# Altium schematic sheet address_detector.SchDoc
size A3
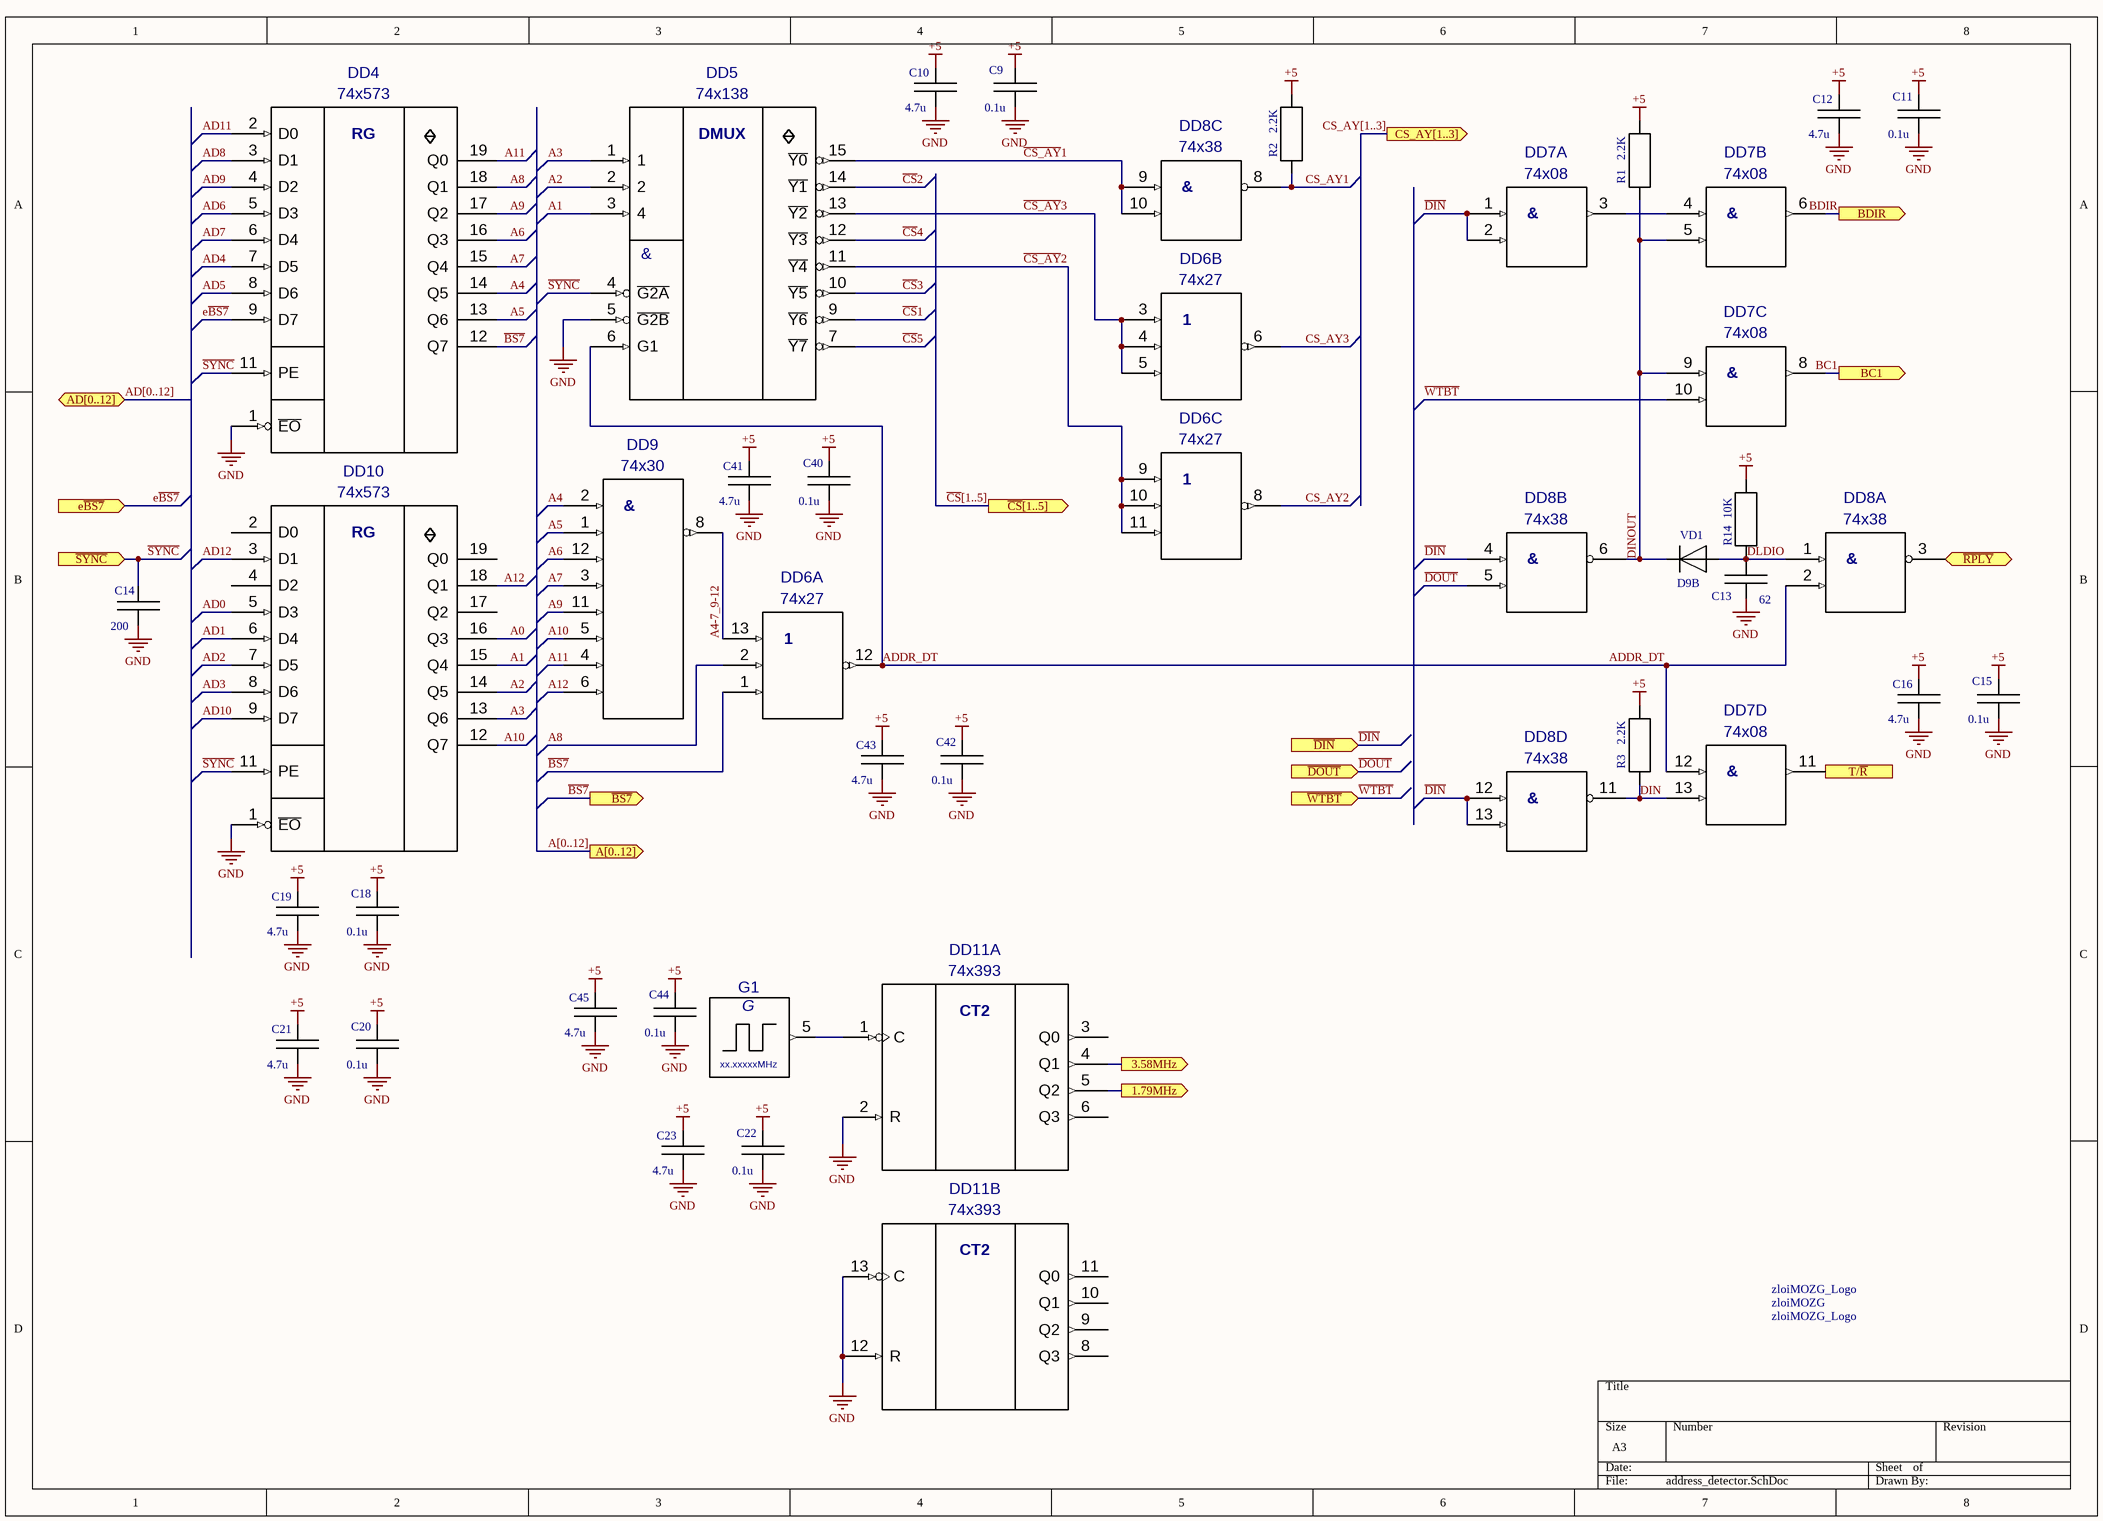
[diagram p0: address_detector.SchDoc]

## Parts
C9  0.1u  [CAP 4x2.5]
C10  4.7u  [CAP 5.5x3.15]
C11  0.1u  [CAP 4x2.5]
C12  4.7u  [CAP 5.5x3.15]
C13  62  [CAP 4x2.5]
C14  200  [CAP 4x2.5]
C15  0.1u  [CAP 4x2.5]
C16  4.7u  [CAP 5.5x3.15]
C18  0.1u  [CAP 4x2.5]
C19  4.7u  [CAP 5.5x3.15]
C20  0.1u  [CAP 4x2.5]
C21  4.7u  [CAP 5.5x3.15]
C22  0.1u  [CAP 4x2.5]
C23  4.7u  [CAP 5.5x3.15]
C40  0.1u  [CAP 4x2.5]
C41  4.7u  [CAP 5.5x3.15]
C42  0.1u  [CAP 4x2.5]
C43  4.7u  [CAP 5.5x3.15]
C44  0.1u  [CAP 4x2.5]
C45  4.7u  [CAP 5.5x3.15]
DD4  74x573  [DIP20]
DD5  74x138  [DIP16]
DD6  74x27  [DIP14]  (parts A,B,C of 3)
DD7  74x08  [DIP14]  (parts A,B,C,D of 4)
DD8  74x38  [DIP14]  (parts A,B,C,D of 4)
DD9  74x30  [DIP14]
DD10  74x573  [DIP20]
DD11  74x393  [DIP14]  (parts A,B of 2)
G1  Frequency: xx.xxxxxMHz  [DIP8 CXO]  (hidden comment: CXO)
R1  2.2K  [Axial Res 0.25]
R2  2.2K  [Axial Res 0.25]
R3  2.2K  [Axial Res 0.25]
R14  10K  [Axial Res 0.25]
VD1  D9B  [D9]
zloiMOZG_Logo  zloiMOZG_Logo  [zloiMOZG_Logo_1.5mm]

## Ports
1.79MHz (out), 3.58MHz (out), A[0..12] (out), AD[0..12] (bidir), BC1 (out), BDIR (out), CS_AY[1..3] (out), e~{BS7} (in), T/~{R} (out), ~{BS7} (out), ~{CS}[1..5] (out), ~{DIN} (in), ~{DOUT} (in), ~{RPLY} (bidir), ~{SYNC} (in), ~{WTBT} (in)

## Nets
+5: C9.2 C10.2 C11.2 C12.2 C15.2 C16.2 C18.2 C19.2 C20.2 C21.2 C22.2 C23.2 C40.2 C41.2 C42.2 C43.2 C44.2 C45.2 DD4.20(+5V) DD5.16(+5) DD6.14(+5V) DD7.14(+5V) DD8.14(+5) DD9.14(+5) DD10.20(+5V) DD11.14(+5) G1.8(+5) R1.1 R2.1 R3.1 R14.1
GND: C9.1 C10.1 C11.1 C12.1 C13.1 C14.1 C15.1 C16.1 C18.1 C19.1 C20.1 C21.1 C22.1 C23.1 C40.1 C41.1 C42.1 C43.1 C44.1 C45.1 DD4.1(~{EO}) DD4.10(GND) DD5.5(~{G2B}) DD5.8(GND) DD6.7(GND) DD7.7(GND) DD8.7(GND) DD9.7(GND) DD10.1(~{EO}) DD10.10(GND) DD11.2(R) DD11.7(GND) DD11.12(R) DD11.13(С) G1.4(GND)
1.79MHz: DD11.5(Q2) ; port 1.79MHz
3.58MHz: DD11.4(Q1) ; port 3.58MHz
A0: DD10.16(Q3)
A1: DD5.3(4) DD10.15(Q4)
A2: DD5.2 DD10.14(Q5)
A3: DD5.1 DD10.13(Q6)
A4: DD4.14(Q5) DD9.2
A4-7_9-12: DD6.13 DD9.8
A5: DD4.13(Q6) DD9.1
A6: DD4.16(Q3) DD9.12
A7: DD4.15(Q4) DD9.3
A8: DD4.18(Q1) DD6.2
A9: DD4.17(Q2) DD9.11
A10: DD9.5 DD10.12(Q7)
A11: DD4.19(Q0) DD9.4
A12: DD9.6 DD10.18(Q1)
AD0: DD10.5(D3)
AD1: DD10.6(D4)
AD2: DD10.7(D5)
AD3: DD10.8(D6)
AD4: DD4.7(D5)
AD5: DD4.8(D6)
AD6: DD4.5(D3)
AD7: DD4.6(D4)
AD8: DD4.3(D1)
AD9: DD4.4(D2)
AD10: DD10.9(D7)
AD11: DD4.2(D0)
AD12: DD10.3(D1)
ADDR_DT: DD5.6(G1) DD6.12 DD7.12 DD8.2
~{BS7}: DD4.12(Q7) DD6.1 ; port ~{BS7}
BC1: DD7.8 ; port BC1
BDIR: DD7.6 ; port BDIR
~{CS}1: DD5.9(~{Y6})
~{CS}2: DD5.14(~{Y1})
~{CS}3: DD5.10(~{Y5})
~{CS}4: DD5.12(~{Y3})
~{CS}5: DD5.7(~{Y7})
~{CS_AY}1: DD5.15(~{Y0}) DD8.9 DD8.10
~{CS_AY}2: DD5.11(~{Y4}) DD6.9 DD6.10 DD6.11
~{CS_AY}3: DD5.13(~{Y2}) DD6.3 DD6.4 DD6.5
CS_AY1: DD8.8 R2.2
CS_AY2: DD6.8
CS_AY3: DD6.6
~{DIN}: DD7.1 DD7.2 DD8.4 DD8.12 DD8.13 ; port ~{DIN}
~{DOUT}: DD8.5 ; port ~{DOUT}
DIN: DD7.13 DD8.11 R3.2
DINOUT: DD7.5 DD7.9 DD8.6 R1.2 VD1.2
DLDIO: C13.2 DD8.1 R14.2 VD1.1
e~{BS7}: DD4.9(D7) ; port e~{BS7}
~{RPLY}: DD8.3 ; port ~{RPLY}
~{SYNC}: C14.2 DD4.11(PE) DD5.4(~{G2A}) DD10.11(PE) ; port ~{SYNC}
T/~{R}: DD7.11 ; port T/~{R}
~{WTBT}: DD7.10 ; port ~{WTBT}
NetDD7_3: DD7.3 DD7.4
NetDD11_1: DD11.1(С) G1.5

Not connected (* = marked no-connect by the designer): DD10 2(D0) 4(D2) 17(Q2) 19(Q0); DD11 3(Q0) 6(Q3) 8(Q3) 9(Q2) 10(Q1) 11(Q0); G1 1(N.C.)

## Buses and harness runs
bus A[0..12] = port A[0..12]
bus AD[0..12] = port AD[0..12]
bus CS_AY[1..3] = port CS_AY[1..3]
bus ~{CS}[1..5] = port ~{CS}[1..5]

## Notes on the sheet
- (in symbol 74x08, part A) &
- (in symbol 74x08, part B) &
- (in symbol 74x08, part C) &
- (in symbol 74x08, part D) &
- (in symbol 74x30) &
- (in symbol 74x38, part A) &
- (in symbol 74x38, part B) &
- (in symbol 74x38, part C) &
- (in symbol 74x38, part D) &
- (in symbol 74x138) DMUX; &
- (in symbol 74x393, part A) CT2
- (in symbol 74x393, part B) CT2
- (in symbol 74x573) RG
- (in symbol CXO) G
- (in symbol zloiMOZG_Logo) zloiMOZG

## Library data of the parts
C9-C16 C18-C23 C40-C45 = Cap: Murata ceramic capacitor
DD4 DD10 = 74x573: ИР22 transparent latch; Value: *
DD5 = 74x138: ИД7 3 to 8 DEMUX; Value: *
DD6 = 74x27: ЛЕ4 3x3NOR; Value: *
DD7 = 74x08: ЛИ1 4x2AND; Value: *
DD8 = 74x38: ЛА13 4x2NAND O.C.; Value: *
DD9 = 74x30: ЛА2 8NAND; Value: *
DD11 = 74x393: ИЕ19; Value: *
R1-R3 R14 = Axial Resistor 0.25
VD1 = Diode